# Altium schematic sheet StellarisCopter.SchDoc
size A4
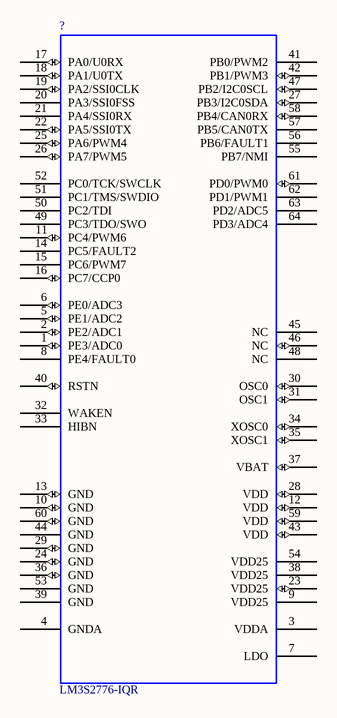
[diagram p0: StellarisCopter.SchDoc]

## Parts
?  LM3S2776-IQR  [QFP50P1200X1200X160-64N]

## Nets

Not connected (* = marked no-connect by the designer): ? 1(PE3/ADC0) 2(PE2/ADC1) 3(VDDA) 4(GNDA) 5(PE1/ADC2) 6(PE0/ADC3) 7(LDO) 8(PE4/FAULT0) 9(VDD25) 10(GND) 11(PC4/PWM6) 12(VDD) 13(GND) 14(PC5/FAULT2) 15(PC6/PWM7) 16(PC7/CCP0) 17(PA0/U0RX) 18(PA1/U0TX) 19(PA2/SSI0CLK) 20(PA3/SSI0FSS) 21(PA4/SSI0RX) 22(PA5/SSI0TX) 23(VDD25) 24(GND) 25(PA6/PWM4) 26(PA7/PWM5) 27(PB3/I2C0SDA) 28(VDD) 29(GND) 30(OSC0) 31(OSC1) 32(WAKEN) 33(HIBN) 34(XOSC0) 35(XOSC1) 36(GND) 37(VBAT) 38(VDD25) 39(GND) 40(RSTN) 41(PB0/PWM2) 42(PB1/PWM3) 43(VDD) 44(GND) 45(NC) 46(NC) 47(PB2/I2C0SCL) 48(NC) 49(PC3/TDO/SWO) 50(PC2/TDI) 51(PC1/TMS/SWDIO) 52(PC0/TCK/SWCLK) 53(GND) 54(VDD25) 55(PB7/NMI) 56(PB6/FAULT1) 57(PB5/CAN0TX) 58(PB4/CAN0RX) 59(VDD) 60(GND) 61(PD0/PWM0) 62(PD1/PWM1) 63(PD2/ADC5) 64(PD3/ADC4)

## Library data of the parts
? = LM3S2776-IQR: Stellaris ARM Cortex-M3 Microcontroller; Manufacturer #1: Luminary Micro; LMI Class: Dust Devil; Designator: U; Part Number: LM3S2776-IQR; Comment_1: LM3S2776-IQR